# Altium schematic sheet f1_bd_1.SchDoc
size A4; SheetNumber: 1; SheetTotal: 1
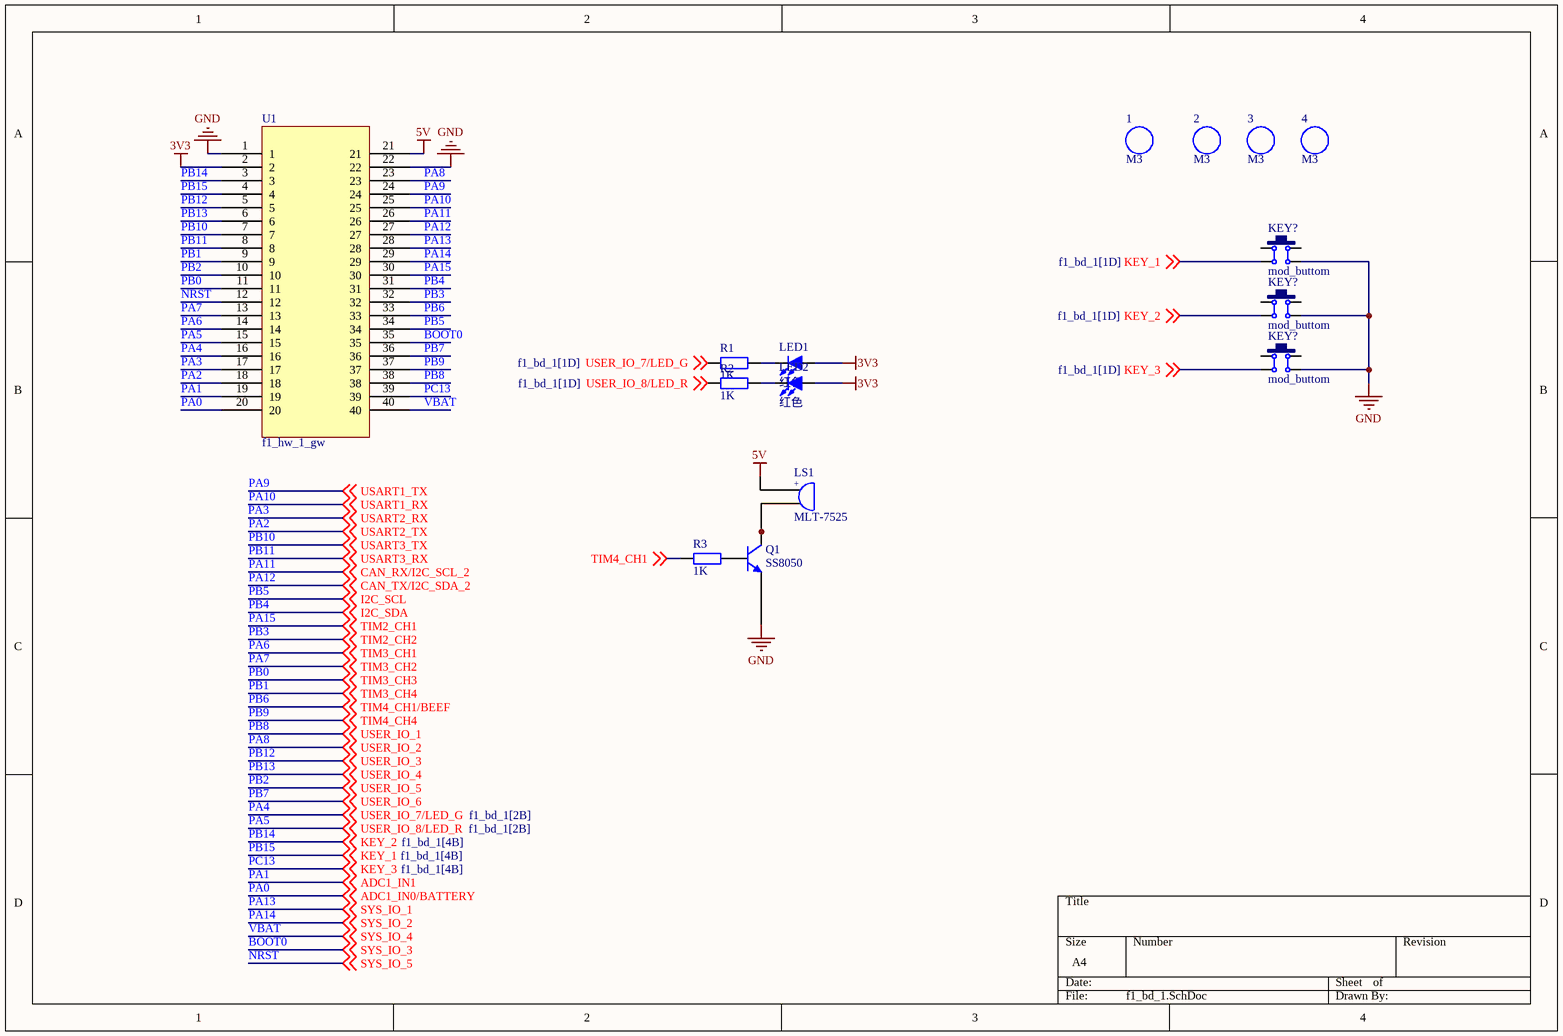
[diagram p0: f1_bd_1.SchDoc]

## Parts
(Parts that share a designator on the sheet are numbered #1, #2 ... from top to bottom, then left to right.)
1  M3  [M3 125X200]
2  M3  [M3 125X200]
3  M3  [M3 125X200]
4  M3  [M3 125X200]
KEY?#1  mod_buttom  [MOD_BUTTOM]
KEY?#2  mod_buttom  [MOD_BUTTOM]
KEY?#3  mod_buttom  [MOD_BUTTOM]
LED1  红色  [LED 3MM-B]
LED2  红色  [LED 3MM-B]
LS1  MLT-7525  [BUZZER_7525_S]
Q1  SS8050  [SOT23-3L]
R1  1K  [R 0603_L]
R2  1K  [R 0603_L]
R3  1K  [R 0603_L]
U1  f1_hw_1_gw  [F1_HW_1_GW]

## Nets
3V3: LED1.1(A) LED2.1(A) U1.2
5V: LS1.1 U1.21
GND: KEY?#1.3 KEY?#2.3 KEY?#3.3 Q1.2(E) U1.1 U1.22
BOOT0: U1.35 ; off-sheet SYS_IO_3  [also labelled SYS_IO_3]
NRST: U1.12 ; off-sheet SYS_IO_5  [also labelled SYS_IO_5]
PA0: U1.20 ; off-sheet ADC1_IN0/BATTERY  [also labelled ADC1_IN0/BATTERY]
PA1: U1.19 ; off-sheet ADC1_IN1  [also labelled ADC1_IN1]
PA2: U1.18 ; off-sheet USART2_TX  [also labelled USART2_TX]
PA3: U1.17 ; off-sheet USART2_RX  [also labelled USART2_RX]
PA4: R1.1 U1.16 ; off-sheet USER_IO_7/LED_G  [also labelled USER_IO_7/LED_G]
PA5: R2.1 U1.15 ; off-sheet USER_IO_8/LED_R  [also labelled USER_IO_8/LED_R]
PA6: U1.14 ; off-sheet TIM3_CH1  [also labelled TIM3_CH1]
PA7: U1.13 ; off-sheet TIM3_CH2  [also labelled TIM3_CH2]
PA8: U1.23 ; off-sheet USER_IO_2  [also labelled USER_IO_2]
PA9: U1.24 ; off-sheet USART1_TX  [also labelled USART1_TX]
PA10: U1.25 ; off-sheet USART1_RX  [also labelled USART1_RX]
PA11: U1.26 ; off-sheet CAN_RX/I2C_SCL_2  [also labelled CAN_RX/I2C_SCL_2]
PA12: U1.27 ; off-sheet CAN_TX/I2C_SDA_2  [also labelled CAN_TX/I2C_SDA_2]
PA13: U1.28 ; off-sheet SYS_IO_1  [also labelled SYS_IO_1]
PA14: U1.29 ; off-sheet SYS_IO_2  [also labelled SYS_IO_2]
PA15: U1.30 ; off-sheet TIM2_CH1  [also labelled TIM2_CH1]
PB0: U1.11 ; off-sheet TIM3_CH3  [also labelled TIM3_CH3]
PB1: U1.9 ; off-sheet TIM3_CH4  [also labelled TIM3_CH4]
PB2: U1.10 ; off-sheet USER_IO_5  [also labelled USER_IO_5]
PB3: U1.32 ; off-sheet TIM2_CH2  [also labelled TIM2_CH2]
PB4: U1.31 ; off-sheet I2C_SDA  [also labelled I2C_SDA]
PB5: U1.34 ; off-sheet I2C_SCL  [also labelled I2C_SCL]
PB6: U1.33 ; off-sheet TIM4_CH1/BEEF  [also labelled TIM4_CH1/BEEF]
PB7: U1.36 ; off-sheet USER_IO_6  [also labelled USER_IO_6]
PB8: U1.38 ; off-sheet USER_IO_1  [also labelled USER_IO_1]
PB9: U1.37 ; off-sheet TIM4_CH4  [also labelled TIM4_CH4]
PB10: U1.7 ; off-sheet USART3_TX  [also labelled USART3_TX]
PB11: U1.8 ; off-sheet USART3_RX  [also labelled USART3_RX]
PB12: U1.5 ; off-sheet USER_IO_3  [also labelled USER_IO_3]
PB13: U1.6 ; off-sheet USER_IO_4  [also labelled USER_IO_4]
PB14: KEY?#2.4 U1.3 ; off-sheet KEY_2  [also labelled KEY_2]
PB15: KEY?#1.4 U1.4 ; off-sheet KEY_1  [also labelled KEY_1]
PC13: KEY?#3.4 U1.39 ; off-sheet KEY_3  [also labelled KEY_3]
TIM4_CH1: R3.1 ; off-sheet TIM4_CH1
VBAT: U1.40 ; off-sheet SYS_IO_4  [also labelled SYS_IO_4]
NetLED1_2: LED1.2(K) R1.2
NetLED2_2: LED2.2(K) R2.2
NetLS1_2: LS1.2 Q1.3(C)
NetQ1_1: Q1.1(B) R3.2

Not connected (* = marked no-connect by the designer): KEY?#1 1 2; KEY?#2 1 2; KEY?#3 1 2

## Notes on the sheet
- (in symbol Buzzer) +

## Library data of the parts
1-4 = prot_m3: m3铜柱孔; BOM名称: 铜柱孔; 版权归属: 源创客; 学习资源: www.ooocke.com
KEY?#1-KEY?#3 = mod_buttom: 6*6*4.3按键
LED1 LED2 = mod_LED: 插件LED; 版权归属: 源创客; BOM名称: 插件LED; 学习资源: www.ooocke.com
LS1 = Buzzer: 蜂鸣器; 版权归属: 源创客; BOM名称: 蜂鸣器; 学习资源: www.ooocke.com
Q1 = 8050-SMD: 高频放大-NPN型; 版权归属: 源创客; 属性: 40V 1.5A 1W 100MHZ; BOM名称: 高频放大-NPN型; 学习资源: www.ooocke.com
R1-R3 = R: 贴片电阻; 版权归属: 源创客; BOM名称: 贴片电阻; 学习资源: www.ooocke.com